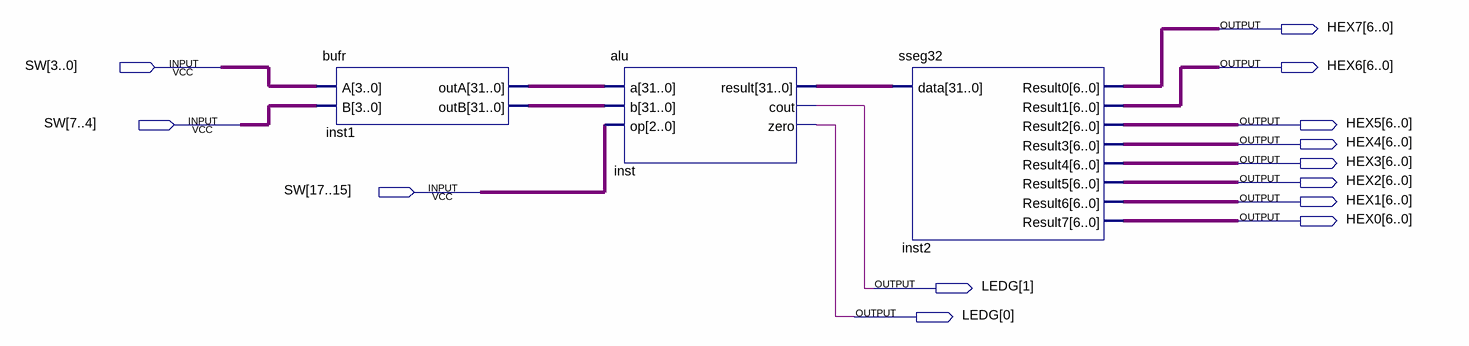
[diagram p0: schematic sheet]
// Quartus schematic lab3_block.bdf as structural Verilog: 3 symbols, 13 pins
module lab3_block (
  input  [17:0] SW,
  output [6:0] HEX7,
  output [6:0] HEX6,
  output [6:0] HEX5,
  output [6:0] HEX4,
  output [6:0] HEX3,
  output [6:0] HEX2,
  output [6:0] HEX1,
  output [6:0] HEX0,
  output [1:0] LEDG
);

  wire [31:0] inst1_outa, inst1_outb, inst_result;

  bufr inst1 (.A(SW[3:0]), .B(SW[7:4]), .outA(inst1_outa), .outB(inst1_outb));
  alu inst (.a(inst1_outa), .b(inst1_outb), .op(SW[17:15]), .result(inst_result), .cout(LEDG[1]), .zero(LEDG[0]));
  sseg32 inst2 (
    .data(inst_result), .Result0(HEX7), .Result1(HEX6), .Result2(HEX5), .Result3(HEX4), .Result4(HEX3),
    .Result5(HEX2), .Result6(HEX1), .Result7(HEX0));
endmodule
